# EAGLE design DWM1000_rev2 (EAGLE 8.6.0)
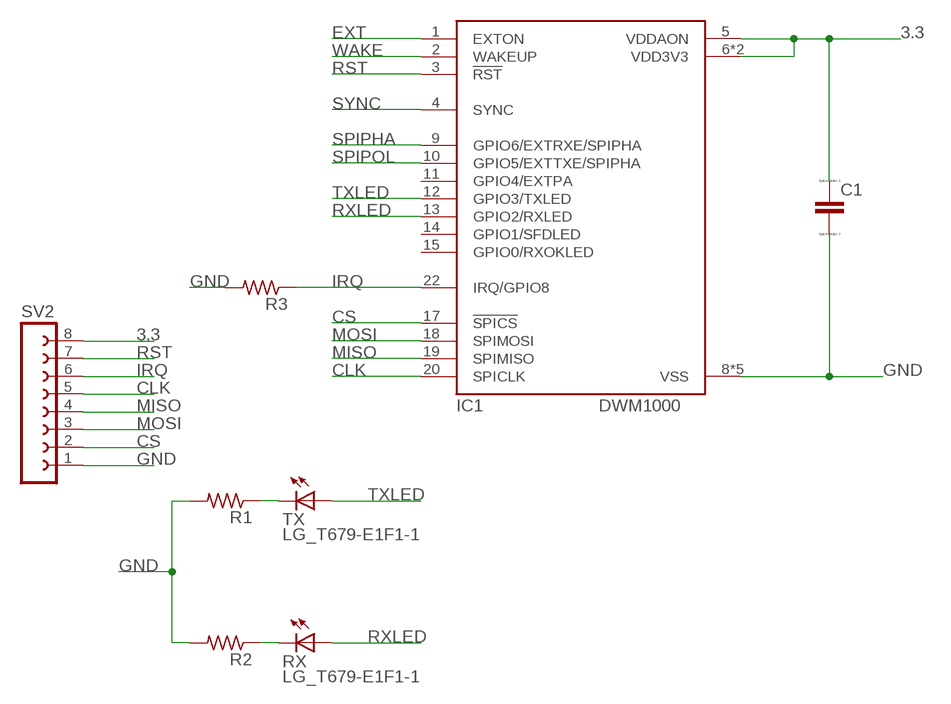
[diagram p0: schematic, sheet 1]

## Parts
C1  CC1206  [C1206]
IC1  DWM1000  [DWM1000]
R1  R-US_M0805  [M0805]
R2  R-US_M0805  [M0805]
R3  R-US_M0805  [M0805]
RX  LG_T679-E1F1-1  [PLCC2]
SV2  FE08-1  [FE08]
TX  LG_T679-E1F1-1  [PLCC2]

## Nets
3.3: C1.1 IC1.5(VDDAON) IC1.6(VDD3V3) IC1.7(VDD3V3) SV2.8
CLK: IC1.20(SPICLK) SV2.5
CS: IC1.17(!SPICS) SV2.2
EXT: IC1.1(EXTON)
GND: C1.2 IC1.8(VSS) IC1.16(VSS) IC1.21(VSS) IC1.23(VSS) IC1.24(VSS) R1.2 R2.2 R3.2 SV2.1
IRQ: IC1.22(IRQ/GPIO8) R3.1 SV2.6
MISO: IC1.19(SPIMISO) SV2.4
MOSI: IC1.18(SPIMOSI) SV2.3
N$1: R1.1 TX.C
N$2: R2.1 RX.C
RST: IC1.3(!RST) SV2.7
RXLED: IC1.13(GPIO2/RXLED) RX.A
SPIPHA: IC1.9(GPIO6/EXTRXE/SPIPHA)
SPIPOL: IC1.10(GPIO5/EXTTXE/SPIPHA)
SYNC: IC1.4(SYNC)
TXLED: IC1.12(GPIO3/TXLED) TX.A
WAKE: IC1.2(WAKEUP)
Unconnected: IC1.11(GPIO4/EXTPA) IC1.14(GPIO1/SFDLED) IC1.15(GPIO0/RXOKLED)

## Library data of the parts
C1 = eagle-ltspice:C: CAPACITOR, European symbol; SPICEMODEL: NONE; SPICEPREFIX: C
IC1 = decawave:DWM1000
R1-R3 = rcl:R-US_: RESISTOR, American symbol; SPICEPREFIX: R
RX TX = led:*_T679-?-1: LC TOPLED® Low Current LED Source: http://catalog.osram-os.com .. LG_LS_LY_T679_OBS.pdf; COLOR: green
SV2 = con-lsta:FE08-1: FEMALE HEADER; OC_FARNELL: unknown; OC_NEWARK: unknown

## Board
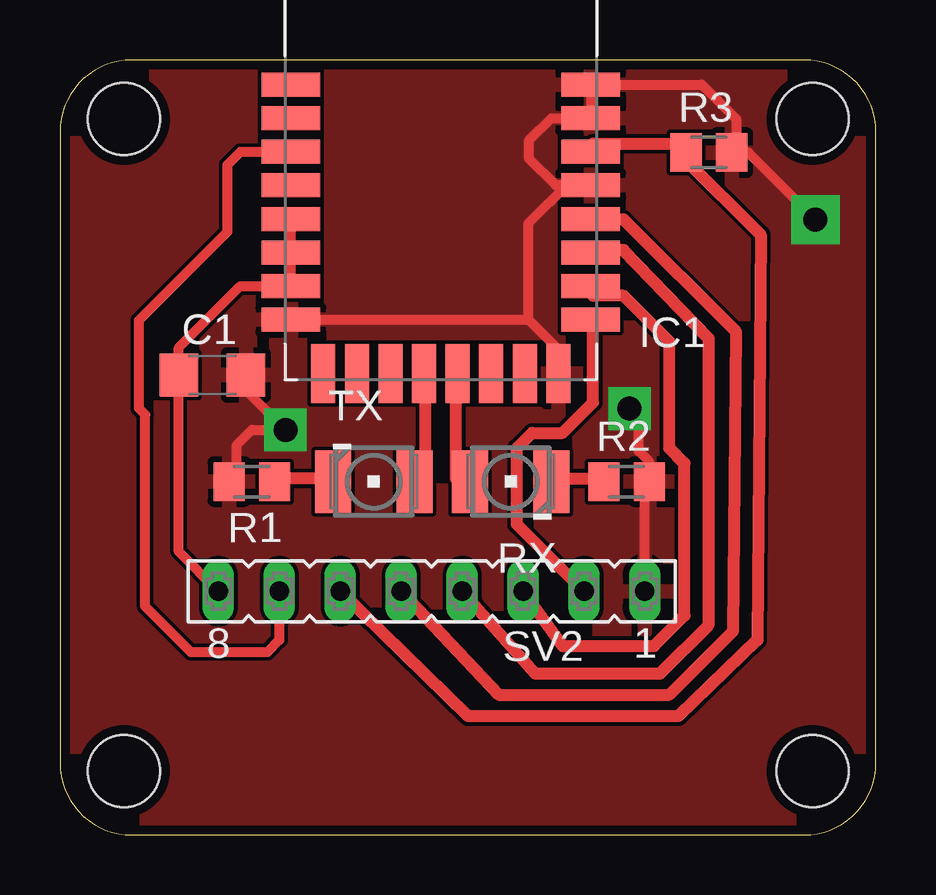
[diagram p1: board, top side]
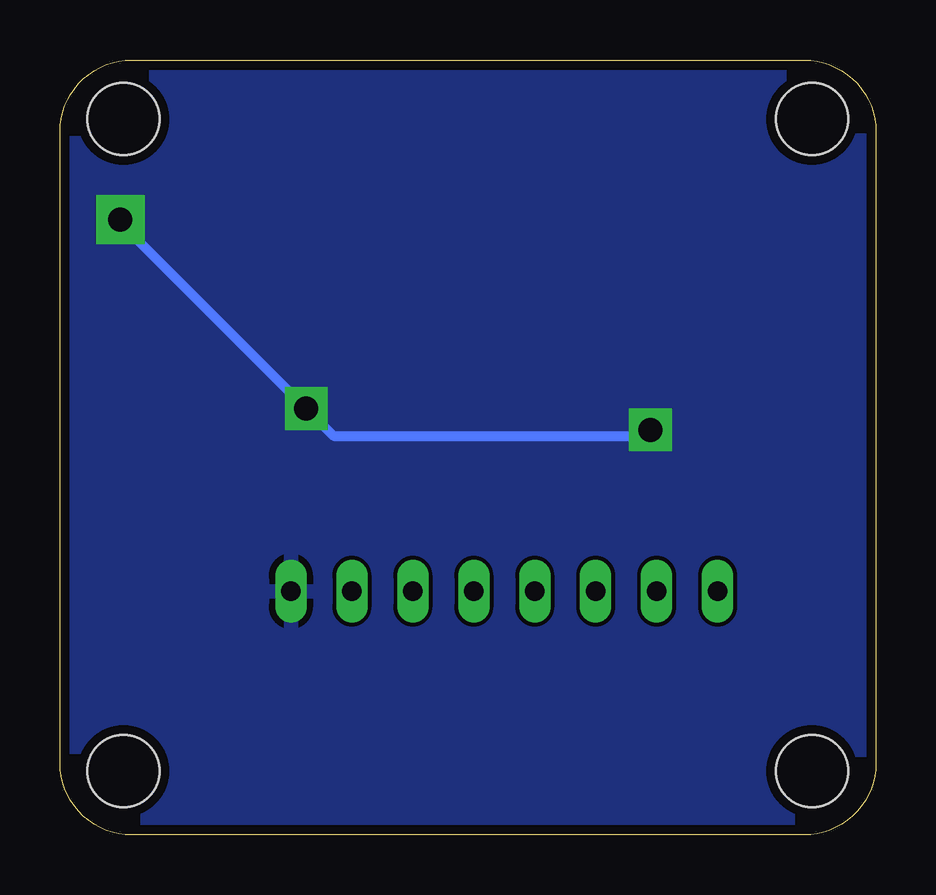
[diagram p2: board, bottom side, seen from below]

Size 34.02 x 32.31 mm. Coordinates in mm from the lower left corner, seen from the top.
Outline: 0,29.31 0,3 arc90 3,0 31.02,0 arc90 34.02,3 34.02,29.31 arc90 31.02,32.31 3,32.31 arc90 0,29.31
Copper layers (1*16): Top 0.035mm / dielectric 1.5mm / Bottom 0.035mm
Design rules "default *": minimum track width 0.5mm, minimum drill 0.35mm, track to track 6mil, track to pad 6mil, pad to pad 6mil, via to via 6mil, smd to smd 6mil, copper to edge 0.4mm, drill to drill 6mil, minimum pad ring 10mil, minimum via ring 8mil, stop-mask expansion 4mil, vias tented up to drill 0mil, thermal gap 10mil
Holes 3 mm at 2.67,29.84 31.37,29.84 2.67,2.67 31.37,2.67

### Footprints (pad centres in the part's own frame; a part is rotated, then mirrored left to right if it is on the bottom)
C1206 = smd 1.6 x 1.8: 1 -1.4,0; 2 1.4,0
DWM1000 = smd 2.45 x 1: 1 -6.25,0.8; 2 -6.25,-0.6; 3 -6.25,-2; 4 -6.25,-3.4; 5 -6.25,-4.8; 6 -6.25,-6.2; 7 -6.25,-7.6; 8 -6.25,-9; 17 6.25,-9; 18 6.25,-7.6; 19 6.25,-6.2; 20 6.25,-4.8; 21 6.25,-3.4; 22 6.25,-2; 23 6.25,-0.6; 24 6.25,0.8 | smd 1 x 2.45: 9 -4.9,-11.25; 10 -3.5,-11.25; 11 -2.1,-11.25; 12 -0.7,-11.25; 13 0.7,-11.25; 14 2.1,-11.25; 15 3.5,-11.25; 16 4.9,-11.25
M0805 = smd 1.3 x 1.6: 1 -0.95,0; 2 0.95,0
PLCC2 = smd 2.6 x 1.5: A 0,1.7; C 0,-1.7
FE08 = drill 0.813 long: 1 -8.89,0; 2 -6.35,0; 3 -3.81,0; 4 -1.27,0; 5 1.27,0; 6 3.81,0; 7 6.35,0; 8 8.89,0

### Placement (x,y rotation side)
C1  6.35,19.18 0 top
IC1  15.88,30.48 0 top
R1  8,14.73 180 top
R2  23.62,14.73 0 top
R3  27.05,28.45 0 top
RX  18.8,14.73 90 top
SV2  15.49,10.16 180 top
TX  13.08,14.73 270 top

### Tracks (layer width: path | path; a pad name or v marks a point on that pad's centre or on a via)
3.3
  Top 0.406: IC1.5 IC1.6 IC1.7 7.51,22.88 4.95,20.32 C1.1 4.95,11.81 SV2.8
CLK
  Top 0.5: SV2.5 18.29,5.84 25.4,5.84 28.07,8.51 28.19,20.95 23.5,25.65 22.23,25.65 IC1.20
CS
  Top 0.5: SV2.2 19.05,12.95 19.05,16.13 19.68,16.76 20.95,16.76 22.23,18.03 22.23,21.21 IC1.17
GND  (via drill 1 pad 1.78, 1 pad 2.03)
  Top 0.406: SV2.1 24.38,14.54 R2.2 24.57,15.56 24.13,16 24.13,17.78 24,17.91 v23.75,17.78 | IC1.8 19.54,21.48 | 19.54,21.48 20.95,20.07 20.77,19.89 IC1.16 | 19.54,21.48 19.54,25.51 21.21,27.18 21.31,27.08 IC1.21 20.67,27.08 19.56,28.19 19.56,28.96 20.48,29.88 IC1.23 IC1.24 26.76,31.28 28.19,29.84 28.19,28.45 | 28.45,28.19 28.19,28.45 | 28.19,28.45 R3.2 | v31.5,25.65 28.7,28.45 28.19,28.45 | R1.2 7.37,15.05 7.37,16.26 8,16.89 v9.4,16.89 7.75,18.54 C1.2
  Bottom 0.406: v31.5,25.65 31.5,25.53 v23.75,17.78 22.61,16.64 9.4,16.64 9.52,16.76 v9.4,16.89
  pour Top: -5.08,35.31 37.34,35.05 36.96,-1.27 -5.21,-1.9
  pour Bottom: -6.35,33.66 -6.73,-0.51 38.23,-1.14 38.61,33.53
IRQ
  Top 0.5: IC1.22 22.23,28.83 26.04,28.83 R3.1 26.04,28.19 29.21,25.02 29.08,8.13 25.78,4.95 17.02,4.95 SV2.6
MISO
  Top 0.5: SV2.4 19.81,6.73 25.02,6.73 27.05,8.76 27.05,20.7 23.5,24.38 22.23,24.38 IC1.19
MOSI
  Top 0.5: SV2.3 20.95,7.87 24.77,7.87 26.04,9.14 26.04,15.49 25.4,16.13 25.4,20.57 23.5,22.48 22.23,22.48 IC1.18
N$1
  Top 0.5: R1.1 9.53,14.86 10.79,14.86 TX.C
N$2
  Top 0.5: R2.1 22.23,14.86 20.95,14.86 RX.C
RST
  Top 0.406: SV2.7 9.14,8.13 8.64,7.62 5.46,7.62 3.56,9.53 3.56,17.53 3.3,17.78 3.3,21.46 6.98,25.15 6.98,27.94 7.53,28.48 IC1.3
RXLED
  Top 0.5: IC1.13 16.51,18.67 16.51,14.86 RX.A
TXLED
  Top 0.5: IC1.12 15.24,18.67 15.24,14.86 TX.A

### Text on the board
tTest: Mikael & Filip | UWB Adapter | TX | RX | 3.3 | RST | IRQ | CLK | MISO | MOSI | CS | GND